# Altium project Fairy Light Controller.PrjPcb
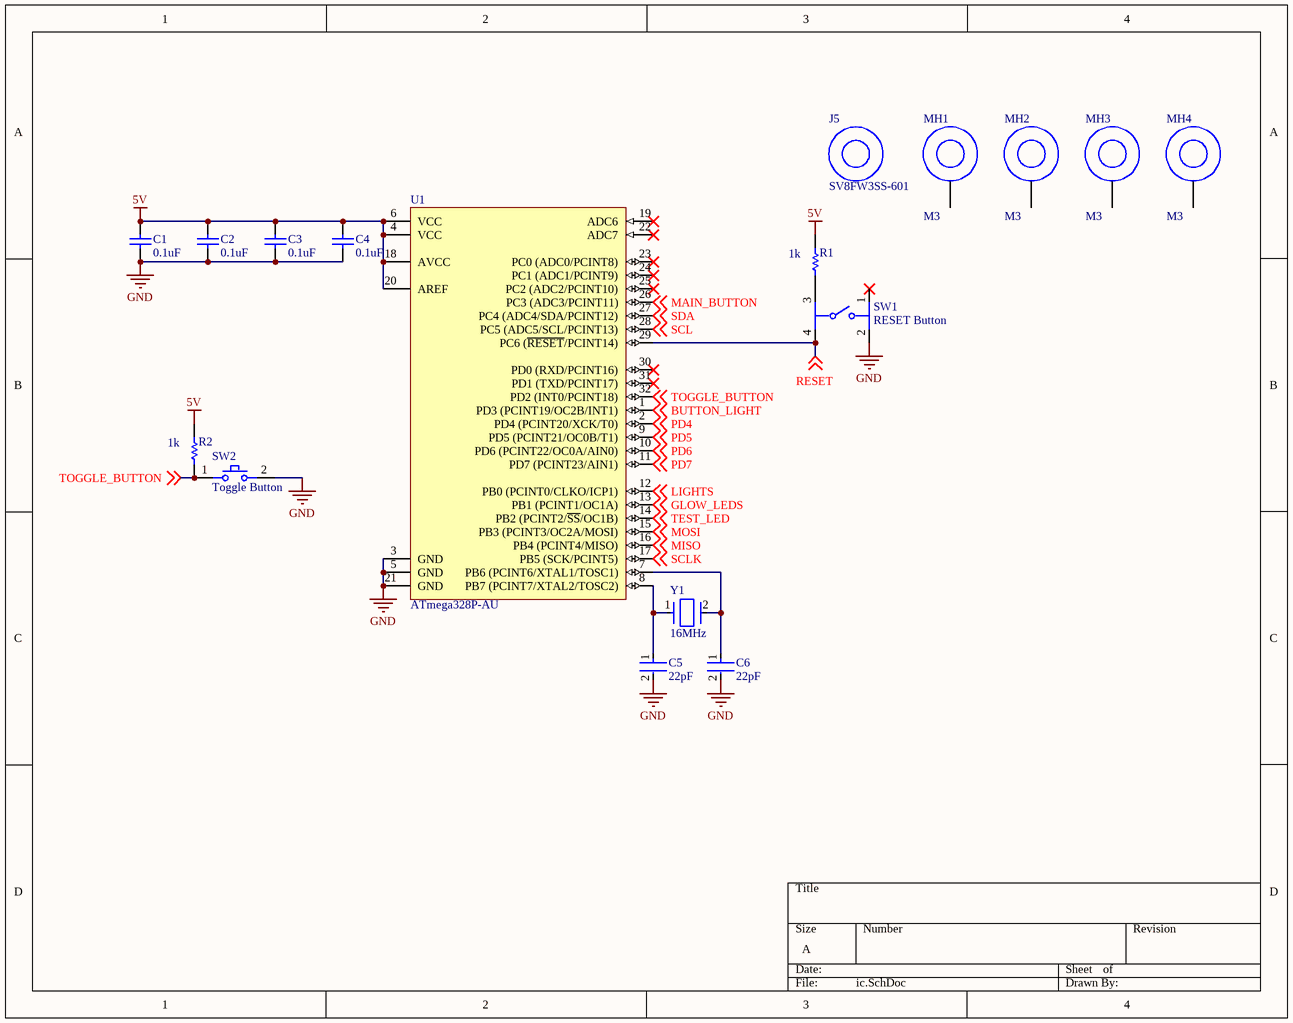
[diagram p0: ic.SchDoc]
2 sheets, 30 parts. Net scope: global (net labels, ports and power ports of the same name join across sheets).
Board file: Fairy_Light_Controller_PCB_v2.PcbDoc
Sheets:
  ic.SchDoc
  headers.SchDoc

## Sheet ic.SchDoc
size A; SheetNumber: 1; SheetTotal: 3

### Parts
C1  0.1uF  [CAPC2013X135X45ML10T25]
C2  0.1uF  [CAPC2013X135X45ML10T25]
C3  0.1uF  [CAPC2013X135X45ML10T25]
C4  0.1uF  [CAPC2013X135X45ML10T25]
C5  22pF  [FP-C0805C-DN-MFG]
C6  22pF  [FP-C0805C-DN-MFG]
J5  SV8FW3SS-601  [SV8FW3SS-601]
MH1  M3  [PTH_M3]  (no BOM)
MH2  M3  [PTH_M3]  (no BOM)
MH3  M3  [PTH_M3]  (no BOM)
MH4  M3  [PTH_M3]  (no BOM)
R1  1k  [RESC2013X50X30NL20T20]
R2  1k  [RESC2013X50X30NL20T20]
SW1  RESET Button  [FP-PTS645SM43SMTR92LFS-MFG]
SW2  Toggle Button  [FP-B3AL-1003P-MFG]
U1  ATmega328P-AU  [32A_M]
Y1  16MHz  [FP-XRCHA-MFG]

### Nets
5V: C1.2 C2.2 C3.2 C4.2 R1.2 R2.2 U1.4(VCC) U1.6(VCC) U1.18(AVCC) U1.20(AREF)
GND: C1.1 C2.1 C3.1 C4.1 C5.2 C6.2 SW1.2 SW2.2 U1.3(GND) U1.5(GND) U1.21(GND)
BUTTON_LIGHT: U1.1(PD3_(PCINT19/OC2B/INT1)) ; off-sheet BUTTON_LIGHT
GLOW_LEDS: U1.13(PB1_(PCINT1/OC1A)) ; off-sheet GLOW_LEDS
LIGHTS: U1.12(PB0_(PCINT0/CLKO/ICP1)) ; off-sheet LIGHTS
MAIN_BUTTON: U1.26(PC3_(ADC3/PCINT11)) ; off-sheet MAIN_BUTTON
MISO: U1.16(PB4_(PCINT4/MISO)) ; off-sheet MISO
MOSI: U1.15(PB3_(PCINT3/OC2A/MOSI)) ; off-sheet MOSI
PD4: U1.2(PD4_(PCINT20/XCK/T0)) ; off-sheet PD4
PD5: U1.9(PD5_(PCINT21/OC0B/T1)) ; off-sheet PD5
PD6: U1.10(PD6_(PCINT22/OC0A/AIN0)) ; off-sheet PD6
PD7: U1.11(PD7_(PCINT23/AIN1)) ; off-sheet PD7
RESET: SW1.4 U1.29(PC6_(~{RESET}/PCINT14)) ; off-sheet RESET
SCL: U1.28(PC5_(ADC5/SCL/PCINT13)) ; off-sheet SCL
SCLK: U1.17(PB5_(SCK/PCINT5)) ; off-sheet SCLK
SDA: U1.27(PC4_(ADC4/SDA/PCINT12)) ; off-sheet SDA
TEST_LED: U1.14(PB2_(PCINT2/~{SS}/OC1B)) ; off-sheet TEST_LED
TOGGLE_BUTTON: R2.1 SW2.1 U1.32(PD2_(INT0/PCINT18)) ; off-sheet TOGGLE_BUTTON
NetC5_1: C5.1 U1.8(PB7_(PCINT7/XTAL2/TOSC2)) Y1.1
NetC6_1: C6.1 U1.7(PB6_(PCINT6/XTAL1/TOSC1)) Y1.2
NetR1_1: R1.1 SW1.3

Not connected (* = marked no-connect by the designer): MH1 1; MH2 1; MH3 1; MH4 1; SW1 1*; U1 19(ADC6)* 22(ADC7)* 23(PC0_(ADC0/PCINT8))* 24(PC1_(ADC1/PCINT9))* 25(PC2_(ADC2/PCINT10))* 30(PD0_(RXD/PCINT16))* 31(PD1_(TXD/PCINT17))*

### Library data of the parts
C1-C4 = CMP-2100-03644-1: Chip Capacitor, 0.1 uF, +/- 10%, 50 V, -55 to 125 degC, 0805 (2012 Metric), RoHS, Tape and Reel; Manufacturer: Murata; MPN: GRM21BR71H104KA01L; Voltage: 50V; Capacitance: 100nF; Insulation Resistance: 10GR; Dielectric Material: Ceramic; Dielectric: X7R; Package Description: 2-Pin Surface Mount Device, Body 2 x 1.25 mm; Manufacturer URL: http://www.murata.com/; Case Code (Imperial): 0805; Datasheet URL: http://psearch.en.murata.com/capacitor/product/GRM21BR71H104KA01%23.pdf; Termination: SMD/SMT; Lead Free: LeadFree; Package Quantity: 1; Mount: SurfaceMount; REACH SVHC: Unknown; Thickness: 0.053inch; Height: 1.25mm; Case/Package: 0805; Voltage Rating: 50V; Width: 0.049inch; Case Code (Metric): 2012; Material: Ceramic; Min Operating Temperature: -55degC; RoHSCompliant: true; Datasheet Version: 42675.0; Voltage Rating (DC): 50V; Tolerance: 10%; Package Reference: 0805; Depth: 1.25mm; Length: 2mm; Max Operating Temperature: 125degC; Packaging: TapeandReel; Number of Pins: 2; Radiation Hardening: No
C5 C6 = CMP-2007-00448-2: CAP CER 22PF 100V 5% NP0 0805; Manufacturer Part Number: C0805C220J1GACTU; Manufacturer: KEMET; Material: Ceramic; Temperature Coefficient: 30ppm/°C; Tolerance: 0.05; Temperature Characteristic: C0G; Value: 22 pF; RoHS: TRUE; ComponentLink2URL: https://content.kemet.com/datasheets/KEM_C1003_C0G_SMD.pdf; Capacitance: 22 pF; Mouser Description: Multilayer Ceramic Capacitor, C Series, 22 Pf, - 5%, C0g / Np0, 100 V, 0805 [2012 Metric] Rohs Compliant: Yes; Digikey Description: CAP CER 22PF 100V 5% NP0 0805; Octopart: https://octopart.com/c0805c220j1gactu-kemet-3791395; Device Class L3: Ceramic Capacitors; Device Class L2: Capacitors; Voltage Rating: 100 V; Temperature Range Low: -55°C; Ipc Land Pattern Name: CAPC200125X78; Lead Free: Yes; ComponentLink2Description: Datasheet; Category: Cap; Temperature: -55°C to +125°C; Package: C0805C-DN; Device Class L1: Passive Components; Temperature Range High: +125°C; Height: 0.88mm; Automotive: No; MPN: C0805C220J1GACTU
MH1-MH4 = PTH: M3 Plated Through Hole; Value: M3
R1 R2 = CMP-1013-00510-2: Part Number: CRCW08051K00FKEA; Manufacturer: Vishay Dale; MPN: CRCW08051K00FKEA
SW1 = CMP-2000-05160-2: SWITCH TACTILE SPST-NO 0.05A 12V; MPN: PTS645SM43SMTR92LFS; Contact Resistance: 100mR; Throw Configuration: SPST; Illumination Type: Non-Illuminated; Mechanical Life: 100000Cycles; Current Rating: 50mA; Switch Function: Off-Mom; Actuator Length: 0.85mm; Actuator Material: Nylon; Actuator Type: Standard; Operating Force: 160gf; Min Operating Temperature: -20°C; REACH SVHC: No SVHC; Termination: Gull Wing; Case/Package: SMD/SMT; Packaging: Tape and Reel; Mount: Surface Mount; Voltage Rating (DC): 12V; Orientation: Straight; Lead Free: Lead Free; Contact Material: Silver; Color: Black; Max Current Rating: 50mA; Contact Plating: Silver; Depth: 9mm; Package Quantity: 1; Max Voltage Rating (DC): 12V; Length: 6mm; Max Operating Temperature: 60°C
SW2 = CMP-08834-000018-1: SWITCH TACTILE SPST-NO 0.05A 16V; MPN: B3AL-1003P; Contact Resistance: 100mR; Illumination Type: Non-Illuminated; Electrical Life: 1000000Cycles; Switch Function: Off-Mom; Switch Travel: 1.3mm; Contact Current Rating: 50mA; Actuator Color: White; Operating Force: 3.5N; Throw Configuration: SPST; Package Quantity: 1; Orientation: Straight; Radiation Hardening: No; Packaging: Tape and Reel; Max Voltage Rating (DC): 16V; Mechanical Life: 1000000Cycles; Min Operating Temperature: -40°C; Depth: 6.6mm; Voltage Rating (DC): 16V; Contact Plating: Silver; Mount: Surface Mount; Series: B3AL; Termination: SMD/SMT; Max Current Rating: 50mA; RoHS Compliant: Yes; Max Operating Temperature: 90°C; Current Rating: 50mA; Length: 6.9mm; Weight: 0.18g
U1 = CMP-0095-00269-2: 8-bit AVR Microcontroller, 32KB Flash, 1KB EEPROM, 2KB SRAM, 32-pin TQFP, Industrial Grade (-40°C to 85°C); PackageDescription: 32-Lead, 7x7x1.0 mm Body, 0.8mm Lead Pitch, Thin Profile Plastic Quad Flat Package (TQFP); DatasheetVersion: revD, May-2011; RevisionNote: DatasheetVersion & PackageVersion updated. URLs added.; ComponentLink1URL: http://www.atmel.com/; ComponentLink2Description: ATmega48A/48PA/88A/88PA/168A/168PA/328/328P Datasheet; Code_JEDEC: MS-026-ABA; ComponentLink1Description: Manufacturer URL; PackageReference: 32A; ComponentLink3Description: ATmega48A/48PA/88A/88PA/168A/168PA/328/328P Summary; ComponentLink2URL: http://www.atmel.com/dyn/resources/prod_documents/doc8271.pdf; PackageVersion: revC, Oct-2010; ComponentLink3URL: http://www.atmel.com/dyn/resources/prod_documents/8271S.pdf
Y1 = CMP-06054-000011-1: CRYSTAL 16.0000MHZ 8PF SMD; MPN: XRCHA16M000F0A01R0; Frequency Stability: 100ppm; ESR (Equivalent Series Resistance): 100R; Frequency: 16MHz; Lead Pitch: 1.45mm; Packaging: Tape and Reel; Ratings: AEC-Q200; Weight: 0.000459oz; Width: 0.079inch; Load Capacitance: 8pF; Termination: SMD/SMT; Length: 0.098inch; Package Quantity: 3000; Frequency Tolerance: 100ppm; Max Operating Temperature: 125°C; Case/Package: SMD/SMT; Min Operating Temperature: -40°C; Height: 0.031inch; Mount: Surface Mount; Tolerance: 100ppm
J5 = SV8FW3SS-601: MPN: SV8FW3SS-601

## Sheet headers.SchDoc
size A; SheetNumber: 2; SheetTotal: 3
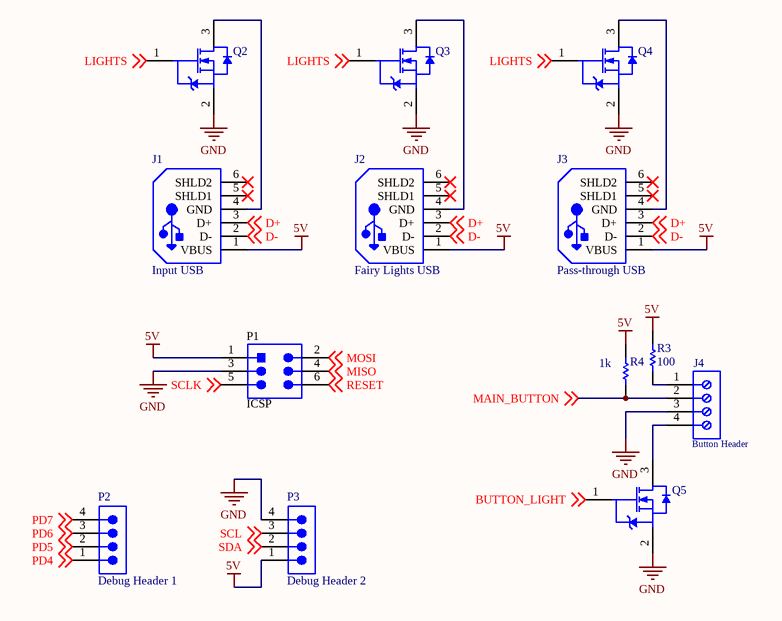
[diagram p1: headers.SchDoc]

### Parts
J1  Input USB  [TE-292303-1_V]
J2  Fairy Lights USB  [TE-292303-1_V]
J3  Pass-through USB  [TE-292303-1_V]
J4  Button Header  [691508110304]
P1  ICSP  [SMTC-TSW-103-08-L-D_V]
P2  Debug Header 1  [SMTC-TSW-104-08-X-S]
P3  Debug Header 2  [SMTC-TSW-104-08-X-S]
Q2  (no value)  [FAIR-FDV303N-3_V]
Q3  (no value)  [FAIR-FDV303N-3_V]
Q4  (no value)  [FAIR-FDV303N-3_V]
Q5  (no value)  [FAIR-FDV303N-3_V]
R3  100  [RESC2013X50X30LL20T20]
R4  1k  [RESC2013X50X30NL20T20]

### Nets
5V: J1.1(VBUS) J2.1(VBUS) J3.1(VBUS) P1.1 P3.1 R3.2 R4.2
GND: J4.3 P1.3 P3.4 Q2.2(S) Q3.2(S) Q4.2(S) Q5.2(S)
BUTTON_LIGHT: Q5.1(G) ; off-sheet BUTTON_LIGHT
D+: J1.3(D+) J2.3(D+) J3.3(D+) ; off-sheet D+
D-: J1.2(D-) J2.2(D-) J3.2(D-) ; off-sheet D-
LIGHTS: Q2.1(G) Q3.1(G) Q4.1(G) ; off-sheet LIGHTS
MAIN_BUTTON: J4.2 R4.1 ; off-sheet MAIN_BUTTON
MISO: P1.4 ; off-sheet MISO
MOSI: P1.2 ; off-sheet MOSI
PD4: P2.1 ; off-sheet PD4
PD5: P2.2 ; off-sheet PD5
PD6: P2.3 ; off-sheet PD6
PD7: P2.4 ; off-sheet PD7
RESET: P1.6 ; off-sheet RESET
SCL: P3.3 ; off-sheet SCL
SCLK: P1.5 ; off-sheet SCLK
SDA: P3.2 ; off-sheet SDA
NetJ1_4: J1.4(GND) Q2.3(D)
NetJ2_4: J2.4(GND) Q3.3(D)
NetJ3_4: J3.4(GND) Q4.3(D)
NetJ4_1: J4.1 R3.1
NetJ4_4: J4.4 Q5.3(D)

Not connected (* = marked no-connect by the designer): J1 5(SHLD1)* 6(SHLD2)*; J2 5(SHLD1)* 6(SHLD2)*; J3 5(SHLD1)* 6(SHLD2)*

### Library data of the parts
J1-J3 = CMP-2000-05404-1: 1 Port Right Angle Through Hole Mount Female Type A USB Connector, 4 Position, -55 to 85 degC, RoHS, Tube; Manufacturer: TE Connectivity; MPN: 292303-1; Contact Termination Type: Solder; No. of Contacts: 4; Connector Mounting: PCB; SVHC: NoSVHC(16-Jun-2014); Gender: Receptacle; Connector Type: USBA; Package Description: 4-Pin Through Hole Device, Body 14 x 13.13 mm, Pitch 2.5 mm; Contact Plating: Gold; Package Reference: 292303-1; Contact Material: Copper; Datasheet URL: http://www.farnell.com/cad/1653030.pdf; Datasheet Version: Feb-12; Manufacturer URL: http://www.te.com/
J4 = CMP-1502-02492-1: Serie 5081 - 3.50 mm Horizontal Entry SMT with Rising Cage Clamp WR-TBL, 4 pin; Manufacturer: Wurth Elektronik; Pitch: 3.50mm; Pin Number: 4; Package Reference: 691508110304; Publisher: WurthElektronik; Part Number: 691508110304; Datasheet URL: http://katalog.we-online.de/em/datasheet/6915081103xx.pdf; Mounting Technology: SMT; Operating Temperature: -40to130degC; Packaging: TapeandReelwithCap; Manufacturer URL: http://www.we-online.de; MPN: 691508110304
P1 = CMP-1024-00336-5: Male Header, Pitch 2.54 mm, 2 x 3 Position, Height 8.38 mm, Tail Length 5.08 mm, -55 to 125 degC, RoHS, Bulk; Manufacturer: Samtec; MPN: TSW-103-08-L-D; DatasheetVersion: 04/2012; ComponentLink3URL: http://suddendocs.samtec.com/prints/tsw-xxx-xx-x-x-xx-xxx-footprint.pdf; PackageReference: TSW-103-08-L-D; Mounting Technology: Through Hole; Min Operating Temperature: -55 degC; ComponentLink2Description: Datasheet; Lead Pitch: 2.54 mm; ComponentLink1Description: Manufacturer URL; Mount: Through Hole; ComponentLink1URL: http://www.samtec.com/; ComponentLink3Description: Package Specification; Max Operating Temperature: 125 degC; PackageDescription: Male Header, Pitch 2.54 mm, 2 x 3 Position, Height 8.38 mm, Tail Length 5.08 mm; ComponentLink2URL: https://datasheet.ciiva.com/25618/0900766b81154476-25618436.pdf; RoHSCompliant: true
P2 P3 = CMP-1024-00356-1: 0.025" SQ Post Header, Through-hole, Vertical, -55 to 105 degC, 2.54 mm Pitch, 4-Pin, Male, RoHS; PartNumber: TSW-104-08-T-S; Manufacturer: Samtec; Pitch: 2.54 mm; PackageDescription: .025[0.64] SQ. Post Terminal Strip Assembly; ComponentLink2URL: http://www.samtec.com/documents/webfiles/pdf/TSW_TH.PDF; ComponentLink3URL: http://www.samtec.com/documents/webfiles/cpdf/TSW-XXX-XX-XXX-X-XX-XXX-MKT.pdf; PackageVersion: DM, 8/1988; ComponentLink3Description: Package Specification; DatasheetVersion: F-214; Orientation: Vertical; RoHS: True; Mounting Technology: Through-hole; ComponentLink1URL: http://www.samtec.com; ComponentLink1Description: Manufacturer URL; Temperature Range: -55 to 105 degC; ComponentLink2Description: Datasheet; PackageReference: TSW-104-08-X-S; MPN: TSW-104-08-T-S
Q2-Q5 = CMP-2000-05111-1: N-Channel MOSFET Transistor, 8 V VGSS, 25 V VDSS, 0.68 A, -55 to 150 degC, 3-Pin SOT23, RoHS, Tape and Reel; Manufacturer: Fairchild; MPN: FDV303N; Typical Turn-On Delay Time: 3ns; Channel Mode: Enhancement; RDS-on: 450@4.5VmOhm; Maximum Continuous Drain Current: 0.68A; Maximum Drain Source Voltage: 25V; Rad Hard: No; Typical Fall Time: 13ns; Channel Type: N; Typical Turn-Off Delay Time: 17ns; Maximum Gate Source Voltage: 8V; Typical Rise Time: 8.5ns; Mounting: SurfaceMount; Packaging: Tape&Reel; Manufacturer URL: https://www.fairchildsemi.com/; Datasheet URL: https://datasheet.ciiva.com/22681/1845307-22681736.pdf; Package: 3SOT-23; Category: MOSFET; Operating Temperature: -55to150degC; Datasheet Version: Rev. D2, 07/2014
R3 = CMP-2001-04901-1: Manufacturer: Vishay Dale; Part Number: CRCW0805100RFKEA; MPN: CRCW0805100RFKEA
R4 = CMP-1013-00510-2: as R1 on sheet ic; MPN: CRCW08051K00FKEA

## Nets that join several sheets
5V: ic (10 pins), headers (7 pins)
GND: ic (11 pins), headers (7 pins)
BUTTON_LIGHT: ic (U1.1), headers (Q5.1)
LIGHTS: ic (U1.12), headers (Q2.1 Q3.1 Q4.1)
MAIN_BUTTON: ic (U1.26), headers (J4.2 R4.1)
MISO: ic (U1.16), headers (P1.4)
MOSI: ic (U1.15), headers (P1.2)
PD4: ic (U1.2), headers (P2.1)
PD5: ic (U1.9), headers (P2.2)
PD6: ic (U1.10), headers (P2.3)
PD7: ic (U1.11), headers (P2.4)
RESET: ic (SW1.4 U1.29), headers (P1.6)
SCL: ic (U1.28), headers (P3.3)
SCLK: ic (U1.17), headers (P1.5)
SDA: ic (U1.27), headers (P3.2)